# Altium schematic sheet Leds_pack.SchDoc
size A
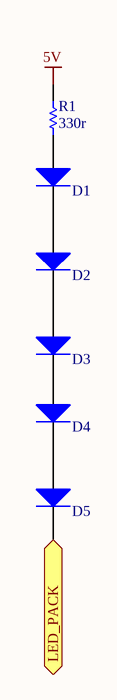
[diagram p0: Leds_pack.SchDoc]

## Parts
D1  LED GREEN 2.2V 20mA 3mm  [SMC]  (value not drawn)
D2  LED GREEN 2.2V 20mA 3mm  [SMC]  (value not drawn)
D3  LED GREEN 2.2V 20mA 3mm  [SMC]  (value not drawn)
D4  LED GREEN 2.2V 20mA 3mm  [SMC]  (value not drawn)
D5  LED GREEN 2.2V 20mA 3mm  [SMC]  (value not drawn)
R1  330r  [AXIAL-0.3]

## Ports
LED_PACK (out)

## Nets
5V: R1.2
LED_PACK: D5.2(K) ; port LED_PACK
NetD1_2: D1.2(K) D2.1(A)
NetD2_2: D2.2(K) D3.1(A)
NetD4_2: D4.2(K) D5.1(A)

Not connected (* = marked no-connect by the designer): D1 1(A); D3 2(K); D4 1(A); R1 1

## Library data of the parts
D1-D5 = Diode: Default Diode; reffabricant: SSL-LX3044GC; fabricant: LUMEX; reffournisseur: 7605456; fournisseur: FARNELL; Published: 8-Jun-2000; LatestRevisionDate: 17-Jul-2002; LatestRevisionNote: Re-released for DXP Platform.; PackageVersion: Sep-1996; PackageReference: SMC; Publisher: Altium Limited; PackageDescription: DO-214-AB/SMC; 2 C-Bend Leads; Body 7.9 x 5.9 mm, inc. leads (LxW); Code_JEDEC: DO-214-AB
R1 = Res1: Resistor; Published: 8-Jun-2000; LatestRevisionDate: 17-Jul-2002; LatestRevisionNote: Re-released for DXP Platform.; PackageReference: AXIAL-0.3; Publisher: Altium Limited; PackageDescription: Axial Device, Thru-Hole; 2 Leads; 0.3 in Pin Spacing; Value: 330r